# Altium schematic sheet attendance_SYS.SchDoc
size A3; SheetNumber: 1; SheetTotal: 1
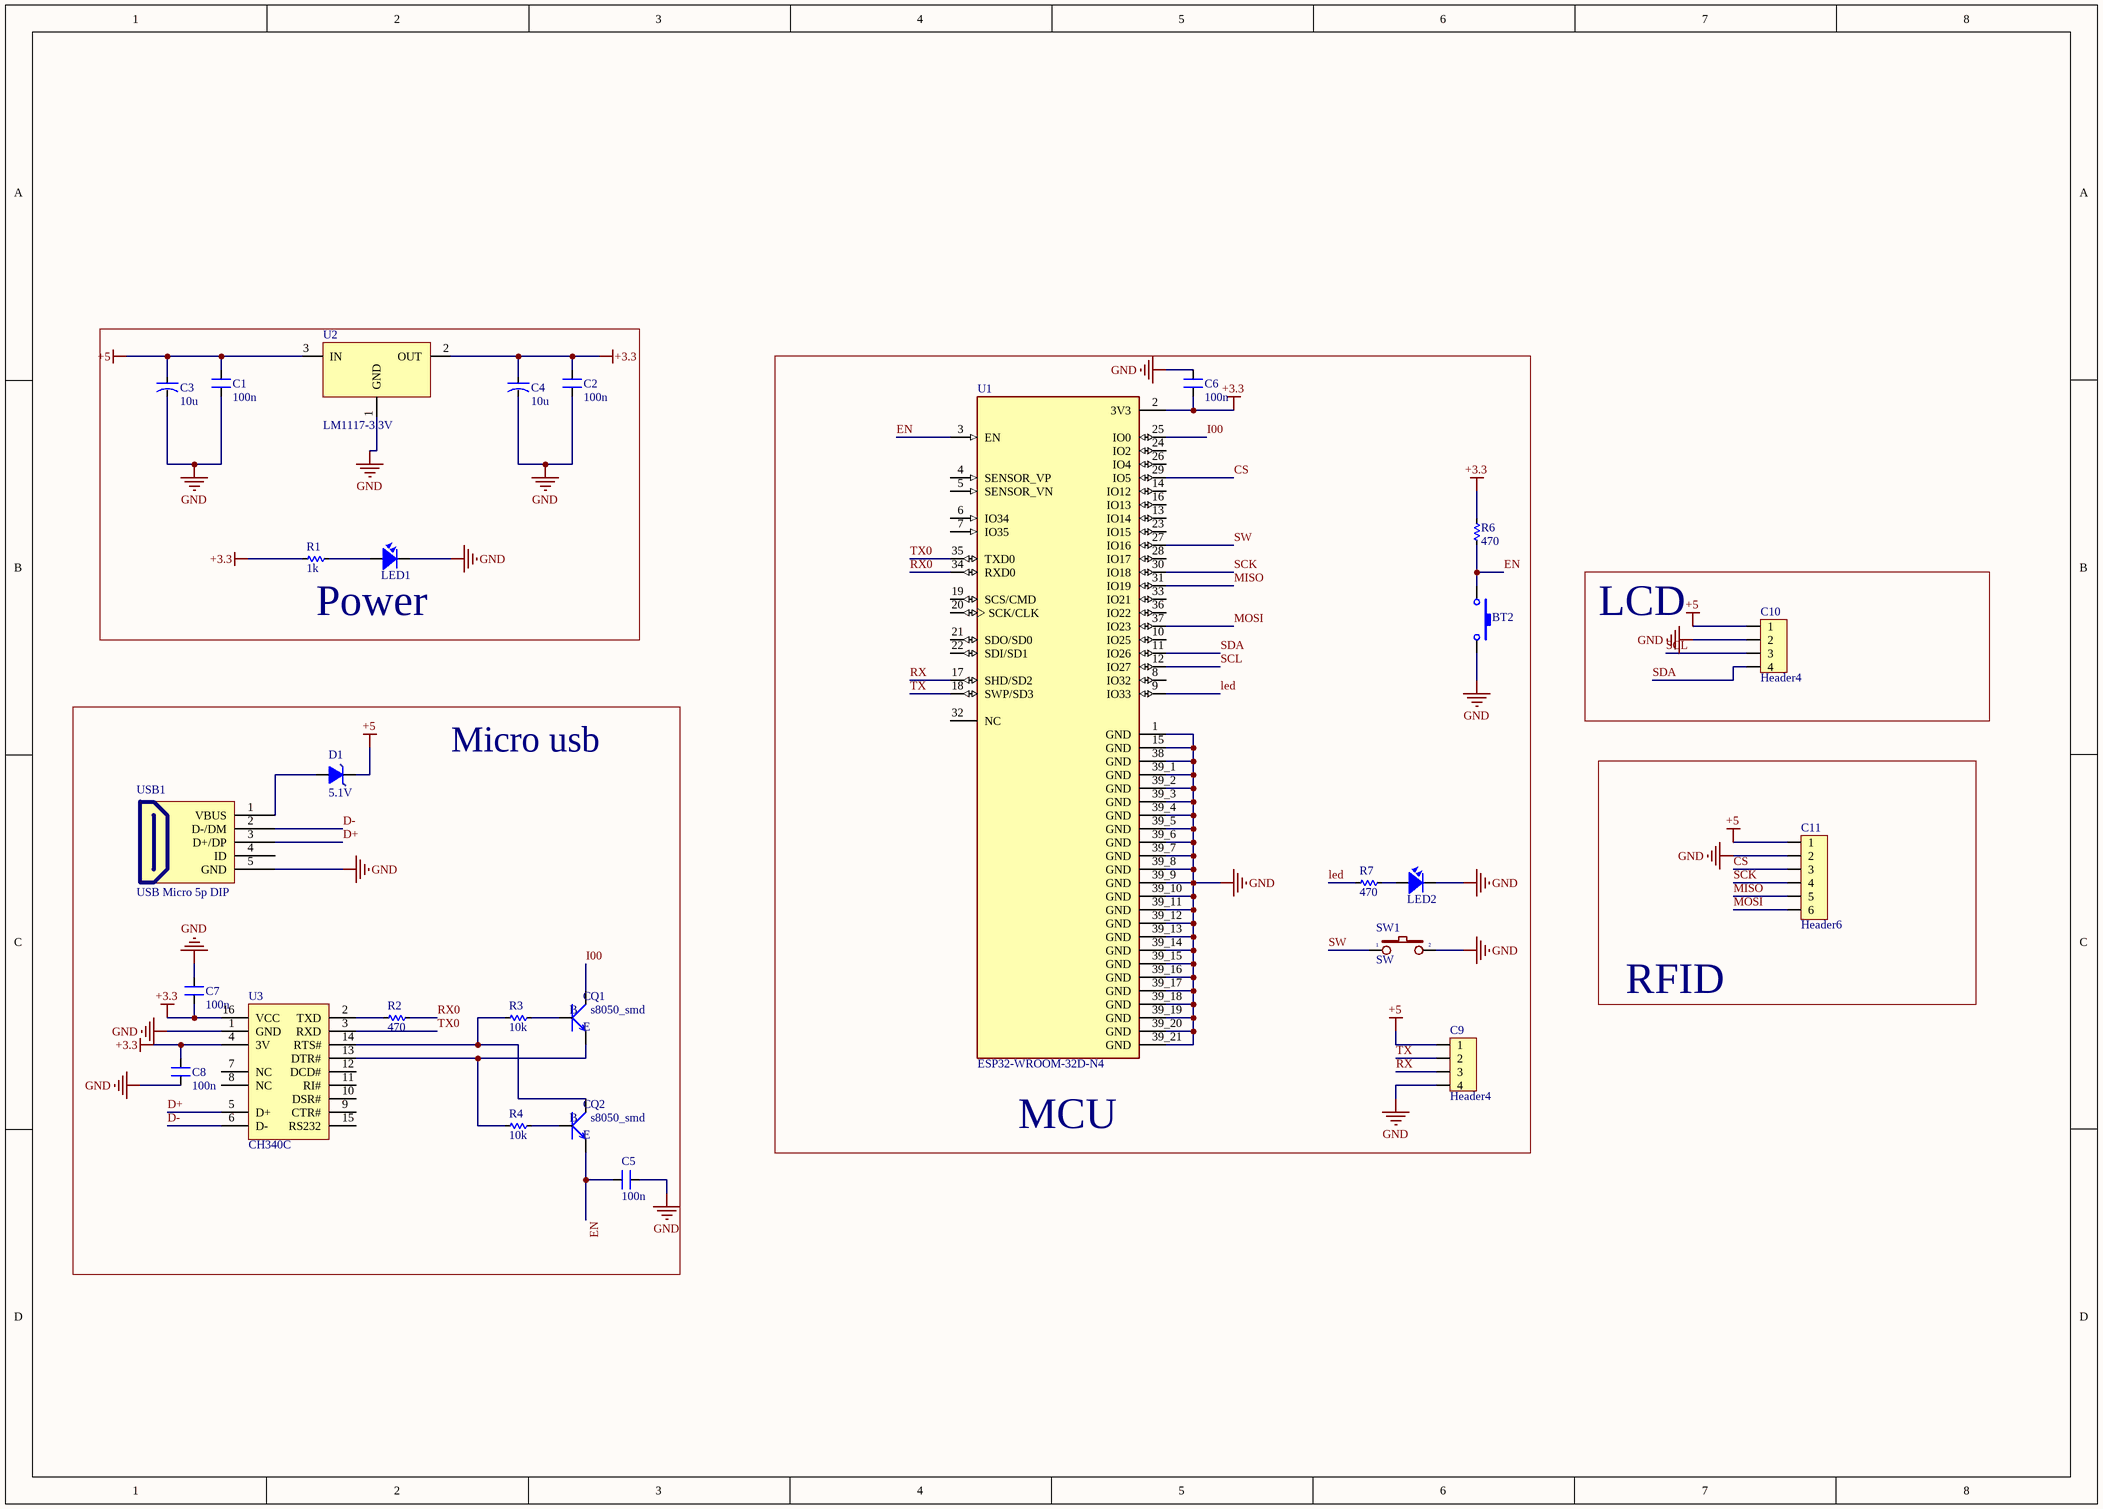
[diagram p0: attendance_SYS.SchDoc]

## Parts
BT2  Nut Nhan 2 Chan SMD 3x6x2.5  [Nut Nhan 2 Chan SMD 3x6x2.5]  (value not drawn)
C1  100n  [CN-SMD-1206]
C2  100n  [CN-SMD-1206]
C3  10u  [CAP-ALU-SMD-5.5x5.5]
C4  10u  [CAP-ALU-SMD-5.5x5.5]
C5  100n  [CN-SMD-1206]
C6  100n  [CN-SMD-1206]
C7  100n  [CN-SMD-1206]
C8  100n  [CN-SMD-1206]
C9  Header4  [HDR4]
C10  Header4  [HDR4]
C11  Header6  [HDR6]
D1  5.1V  [DIODE ZENNER SMD SOD80]
LED1  LED  [LED-1206-Red]  (value not drawn)
LED2  LED  [LED-5MM-GREEN]  (value not drawn)
Q1  s8050_smd  [SOT-23]
Q2  s8050_smd  [SOT-23]
R1  1k  [RES-SMD-1206]
R2  470  [RES-SMD-1206]
R3  10k  [RES-SMD-1206]
R4  10k  [RES-SMD-1206]
R6  470  [RES-SMD-1206]
R7  470  [RES-SMD-1206]
SW1  SW  [SW1-DIP-12x12x8-Red]
U1  ESP32-WROOM-32D-N4  [MODULE_ESP32-WROOM-32D-N4]
U2  LM1117-3.3V  [SOT223]
U3  CH340C  [SO16]
USB1  USB Micro 5p DIP  [USB Micro 5p DIP]

## Blocks framed on the sheet
Power: C1-C4 LED1 R1 U2
MCU: BT2 C6 C9 LED2 R6 R7 SW1 U1
LCD: C10
Micro usb: C5 C7 C8 D1 Q1 Q2 R2-R4 U3 USB1
RFID: C11

## Nets
+3.3: C2.1 C4.1 C6.2 C7.2 C8.1 R1.2 R6.2 U1.2(3V3) U2.2(OUT) U3.4(3V) U3.16(VCC)
+5: C1.1 C3.1 C9.1 C10.1 C11.1 D1.2(K) U2.3(IN)
GND: BT2.2 C1.2 C2.2 C3.2 C4.2 C5.2 C6.1 C7.1 C8.2 C9.4 C10.2 C11.2 LED1.2 LED2.2 SW1.2 U1.1(GND) U1.15(GND) U1.38(GND) U1.39_1(GND) U1.39_2(GND) U1.39_3(GND) U1.39_4(GND) U1.39_5(GND) U1.39_6(GND) U1.39_7(GND) U1.39_8(GND) U1.39_9(GND) U1.39_10(GND) U1.39_11(GND) U1.39_12(GND) U1.39_13(GND) U1.39_14(GND) U1.39_15(GND) U1.39_16(GND) U1.39_17(GND) U1.39_18(GND) U1.39_19(GND) U1.39_20(GND) U1.39_21(GND) U2.1(GND) U3.1(GND) USB1.5(GND)
CS: C11.3 U1.29(IO5)
D+: U3.5(D+) USB1.3(D+/DP)
D-: U3.6(D-) USB1.2(D-/DM)
EN: BT2.1 C5.1 Q2.2(E) R6.1 U1.3(EN)
I00: Q1.3(C) U1.25(IO0)
led: R7.2 U1.9(IO33)
MISO: C11.5 U1.31(IO19)
MOSI: C11.6 U1.37(IO23)
RX: C9.3 U1.17(SHD/SD2)
RX0: R2.1 U1.34(RXD0)
SCK: C11.4 U1.30(IO18)
SCL: C10.3 U1.12(IO27)
SDA: C10.4 U1.11(IO26)
SW: SW1.1 U1.27(IO16)
TX: C9.2 U1.18(SWP/SD3)
TX0: U1.35(TXD0) U3.3(RXD)
NetD1_1: D1.1(A) USB1.1(VBUS)
NetLED1_1: LED1.1 R1.1
NetLED2_1: LED2.1 R7.1
NetQ1_1: Q1.1(B) R3.1
NetQ1_2: Q1.2(E) R4.2 U3.13(DTR#)
NetQ2_1: Q2.1(B) R4.1
NetQ2_3: Q2.3(C) R3.2 U3.14(RTS#)
NetR2_2: R2.2 U3.2(TXD)

Not connected (* = marked no-connect by the designer): U1 4(SENSOR_VP) 5(SENSOR_VN) 6(IO34) 7(IO35) 8(IO32) 10(IO25) 13(IO14) 14(IO12) 16(IO13) 19(SCS/CMD) 20(SCK/CLK) 21(SDO/SD0) 22(SDI/SD1) 23(IO15) 24(IO2) 26(IO4) 28(IO17) 32(NC) 33(IO21) 36(IO22); U3 7(NC) 8(NC) 9(CTR#) 10(DSR#) 11(RI#) 12(DCD#) 15(RS232); USB1 4(ID)

## Library data of the parts
BT2 = Nut Nhan 2 Chan SMD 3x6x2.5: Ma_Hang: MH001036; Ten: Nút Nhấn 2 Chân 3x6x2.5MM SMD
C1 C2 C5-C8 = CN: Value: 33pF
C3 C4 = CN-SMD: Polarized Capacitor (Axial); Published: 8-Jun-2000; LatestRevisionDate: 17-Jul-2002; LatestRevisionNote: Re-released for DXP Platform.; PackageReference: POLAR0.8; Publisher: Altium Limited
C9 C10 = Header4: Header IDC, 4 x 1 Pin Vertical 2.54mm Pitch (Non-Boxed, Male); Manufacturer: W¨¹rth Elektronik eiSos GmbH; partNo: 613002143121; ComponentLink1 Description: Manufacturer; ComponentLink2 Description: Datasheet; NoPins: 02; Created Date: 29 March 2013; ComponentLink1URL: http://www.we-online.com; ComponentLink2URL: http://katalog.we-online.de/em/datasheet/6130xx143121.pdf; Created by: Karrer Zheng
C11 = Header6: Header IDC, 6 x 1 Pin Vertical 2.54mm Pitch (Non-Boxed, Male); Manufacturer: W¨¹rth Elektronik eiSos GmbH; partNo: 613002143121; ComponentLink1 Description: Manufacturer; ComponentLink2 Description: Datasheet; NoPins: 02; Created Date: 29 March 2013; ComponentLink1URL: http://www.we-online.com; ComponentLink2URL: http://katalog.we-online.de/em/datasheet/6130xx143121.pdf; Created by: Karrer Zheng
D1 = Diode Zener 5.1V: Dán; Ma_Hang: MH002881; Ten_Linh_Kien: Diode Zener 1/2W 5.1V SMD1206 ZMM5.1; Don_Vi: Con; Kieu_Chan: *; Ghi_Chu: *; Chung_Loai: Dán
LED1 = LED SMD: Value: LED 3 - 5 ly 2 Colour
LED2 = LED: LED Single colour Green and Red; Value: LED 3 ly Single Colour
Q1 Q2 = s8050_smd: Bipolar (BJT) Transistor NPN 25 V 500 mA 150MHz 300 mW Surface Mount SOT-23; MF: UMW; MP: S8050; Purchase-URL: https://pricing.snapeda.com/search/part/S8050/?ref=eda; Check_prices: https://www.snapeda.com/parts/S8050/Umwelt+Sensor+Teknik/view-part/?ref=eda; SnapEDA_Link: https://www.snapeda.com/parts/S8050/Umwelt+Sensor+Teknik/view-part/?ref=snap; Price: None; Availability: In Stock; Package: None; Value: *
R1-R4 R6 R7 = Res-SMD: Resistor; Manufacturer: Generic Components; Class: Passive; Published: 08/06/2000; Publisher: Altium Hobart Technology Centre
SW1 = SW2: Switch button 2 pin; Value: SW chip 2 pin
U1 = ESP32-WROOM-32D-N4: Bluetooth, WiFi 802.11b/g/n, Bluetooth v4.2 +EDR, Class 1, 2 and 3 Transceiver Module 2.4GHz ~ 2.5GHz Integrated, Trace Surface Mount; MF: Espressif Systems; SnapEDA_Link: https://www.snapeda.com/parts/ESP32-WROOM-32D-N4/Espressif+Systems/view-part/?ref=snap; Package: Non Standard Espressif Systems; Value: *; MP: ESP32-WROOM-32D-N4; Check_prices: https://www.snapeda.com/parts/ESP32-WROOM-32D-N4/Espressif+Systems/view-part/?ref=eda
U2 = LM1117: 800mA Low-Dropout Linear Regulator; Creator: Nguyen Ba Bien; Website: http://group3i.net
U3 = CH340C: High and Low Side Driver; Note: Pins 4, 8 and 14 are not connected; Published: 8-Jun-2000; LatestRevisionDate: 04-Mar-2005; LatestRevisionNote: Stylized 3D Model Added.; DatasheetVersion: PD60147J; PackageReference: PDIP14; Publisher: Altium Limited; PackageDescription: DIP; 14 Leads; Row Spacing 7.62 mm; Pitch 2.54 mm; ComponentLink1Description: Manufacturer Link; ComponentLink1URL: http://www.irf.com/; ComponentLink2Description: Datasheet; ComponentLink2URL: http://www.irf.com/product-info/datasheets/data/ir2110.pdf
USB1 = USB Micro 5p DIP: USB Type B; Ten: MicroUSB MK5P DIP; Ma_Hang: MH005145